# EAGLE schematic Klon (EAGLE 9.5.2)
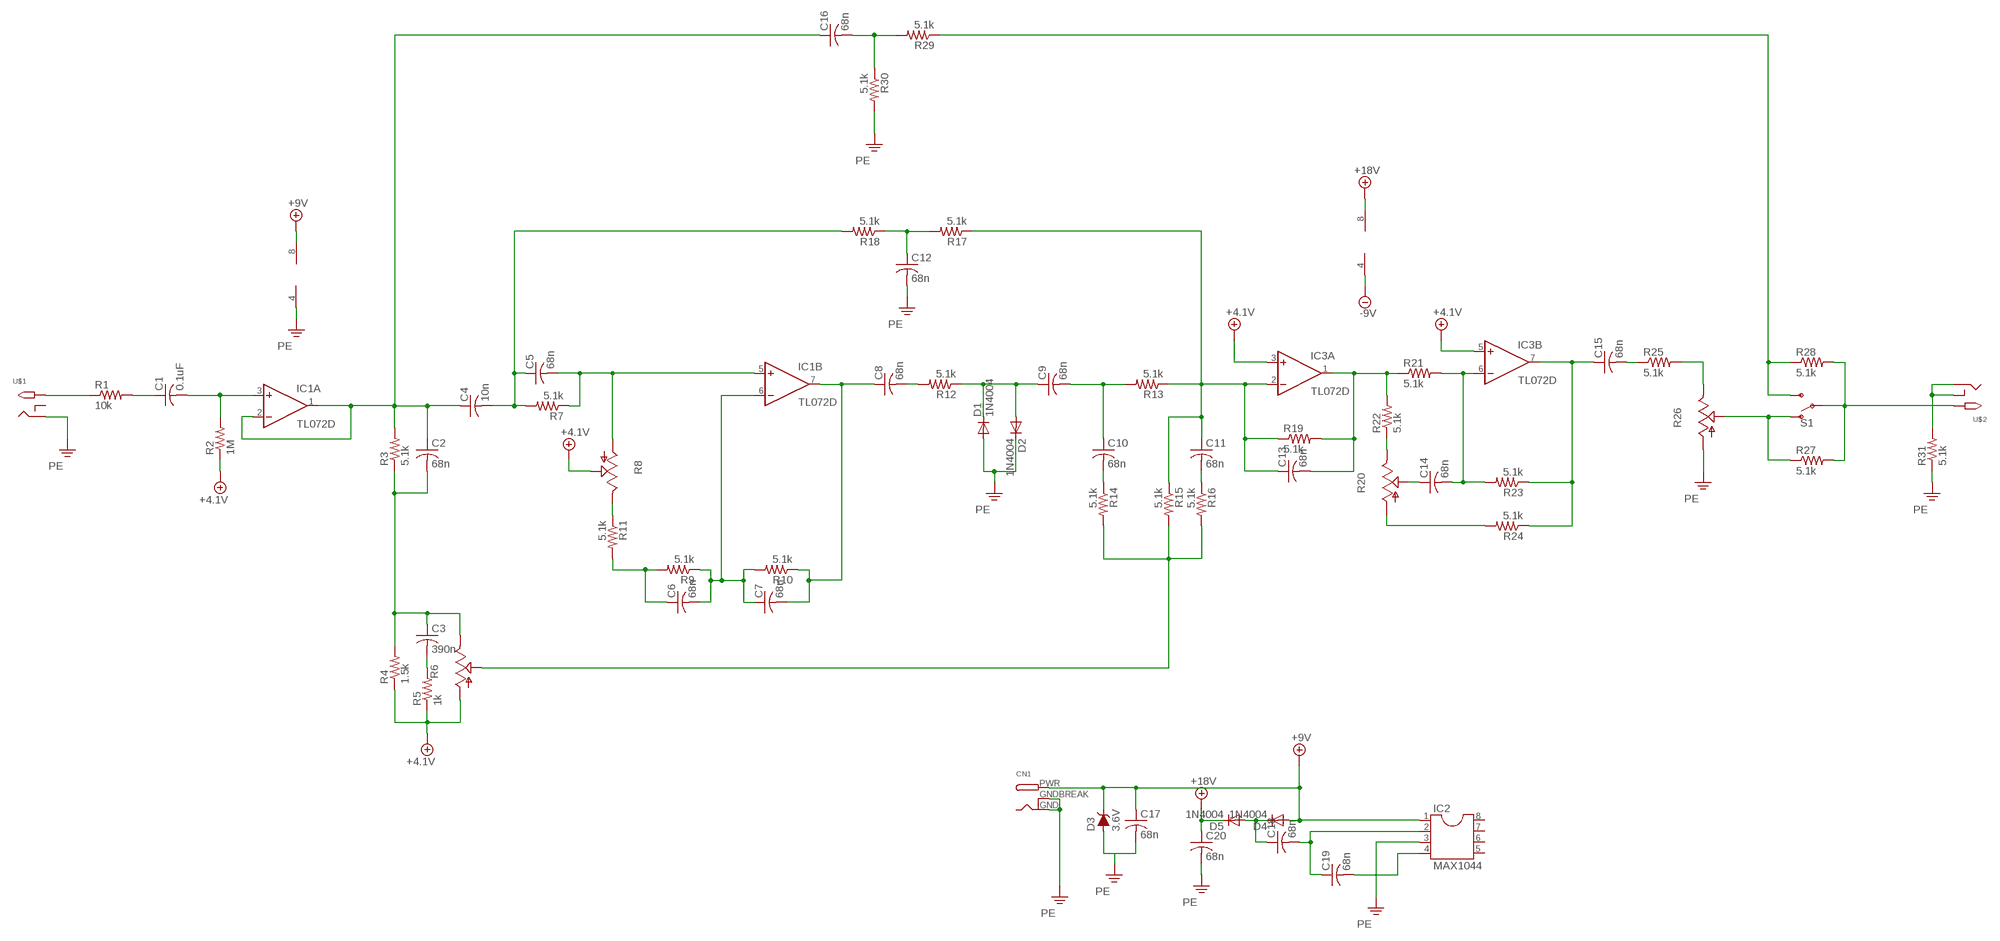
[diagram p0: schematic, sheet 1]

## Parts
C1  0.1uF  C-USC0603  [C0603]
C2  68n  C-USC0603  [C0603]
C3  390n  C-USC0603  [C0603]
C4  10n  C-USC0603  [C0603]
C5  68n  C-USC0603  [C0603]
C6  68n  C-USC0603  [C0603]
C7  68n  C-USC0603  [C0603]
C8  68n  C-USC0603  [C0603]
C9  68n  C-USC0603  [C0603]
C10  68n  C-USC0603  [C0603]
C11  68n  C-USC0603  [C0603]
C12  68n  C-USC0603  [C0603]
C13  68n  C-USC0603  [C0603]
C14  68n  C-USC0603  [C0603]
C15  68n  C-USC0603  [C0603]
C16  68n  C-USC0603  [C0603]
C17  68n  C-USC0603  [C0603]
C18  68n  C-USC0603  [C0603]
C19  68n  C-USC0603  [C0603]
C20  68n  C-USC0603  [C0603]
CN1  DCBARRELPTH  [DCJACK_2MM_PTH]
D1  1N4004  [DO41-10]
D2  1N4004  [DO41-10]
D3  3.6V  DIODE-ZENER-BZT52C3V6S  [SOD-323]
D4  1N4004  [DO41-10]
D5  1N4004  [DO41-10]
IC1  TL072D  [SO08]
IC2  MAX1044  [DIL08]
IC3  TL072D  [SO08]
R1  10k  R-US_R0603  [R0603]
R2  1M  R-US_R0603  [R0603]
R3  5.1k  R-US_R0603  [R0603]
R4  1.5k  R-US_R0603  [R0603]
R5  1k  R-US_R0603  [R0603]
R6  TRIM_US-3223G  [3223G]
R7  5.1k  R-US_R0603  [R0603]
R8  TRIM_US-3223G  [3223G]
R9  5.1k  R-US_R0603  [R0603]
R10  5.1k  R-US_R0603  [R0603]
R11  5.1k  R-US_R0603  [R0603]
R12  5.1k  R-US_R0603  [R0603]
R13  5.1k  R-US_R0603  [R0603]
R14  5.1k  R-US_R0603  [R0603]
R15  5.1k  R-US_R0603  [R0603]
R16  5.1k  R-US_R0603  [R0603]
R17  5.1k  R-US_R0603  [R0603]
R18  5.1k  R-US_R0603  [R0603]
R19  5.1k  R-US_R0603  [R0603]
R20  TRIM_US-3223G  [3223G]
R21  5.1k  R-US_R0603  [R0603]
R22  5.1k  R-US_R0603  [R0603]
R23  5.1k  R-US_R0603  [R0603]
R24  5.1k  R-US_R0603  [R0603]
R25  5.1k  R-US_R0603  [R0603]
R26  TRIM_US-3223G  [3223G]
R27  5.1k  R-US_R0603  [R0603]
R28  5.1k  R-US_R0603  [R0603]
R29  5.1k  R-US_R0603  [R0603]
R30  5.1k  R-US_R0603  [R0603]
R31  5.1k  R-US_R0603  [R0603]
S1  SWITCH-SPDT-PTH-11.6X4.0MM  [SWITCH_SPDT_PTH_11.6X4.0MM]
U$1  2.1MMJACKSMT  [DCJACK_2MM_SMT]
U$2  2.1MMJACKSMT  [DCJACK_2MM_SMT]

## Nets
+4.1V: IC3.3(A:+IN) IC3.5(B:+IN) R2.1 R4.1 R5.1 R6.1(A) R8.2(S)
+9V: C17.1 CN1.PWR D3.C D4.A IC1.8(P:V+) IC2.1
+18V: C20.1 D5.C IC3.8(P:V+)
-9V: IC3.4(P:V-)
N$1: C1.1 R1.2
N$2: C1.2 IC1.3(A:+IN) R2.2
N$3: C2.1 C4.1 C16.1 IC1.1(A:OUT) IC1.2(A:-IN) R3.2
N$4: C2.2 C3.1 R3.1 R4.2 R6.3(E)
N$5: C4.2 C5.1 R7.2 R18.2
N$6: C3.2 R5.2
N$7: C5.2 IC1.5(B:+IN) R7.1 R8.1(A)
N$8: C6.2 C7.1 IC1.6(B:-IN) R9.1 R10.2
N$9: R8.3(E) R11.1
N$10: C6.1 R9.2 R11.2
N$11: C7.2 C8.1 IC1.7(B:OUT) R10.1
N$12: C12.1 R17.2 R18.1
N$13: C8.2 R12.2
N$14: C9.1 D1.C D2.A R12.1
N$15: C9.2 C10.1 R13.2
N$16: C10.2 R14.1
N$17: R6.2(S) R14.2 R15.2 R16.2
N$18: C11.2 R16.1
N$19: C11.1 C13.1 IC3.2(A:-IN) R13.1 R15.1 R17.1 R19.1
N$20: C14.2 IC3.6(B:-IN) R21.2 R23.2
N$21: C13.2 IC3.1(A:OUT) R19.2 R21.1 R22.2
N$22: R20.3(E) R22.1
N$23: C14.1 R20.2(S)
N$24: R20.1(A) R24.2
N$25: C15.1 IC3.7(B:OUT) R23.1 R24.1
N$26: R26.2(S) R27.1 S1.1(O)
N$27: C15.2 R25.1
N$28: R25.2 R26.3(E)
N$29: R27.2 R28.2 S1.2(P) U$2.PWR2(TIP)
N$30: R28.1 R29.1 S1.3(S)
N$31: C16.2 R29.2 R30.1
N$32: R1.1 U$1.PWR2(TIP)
N$33: R31.2 U$2.GND(RING) U$2.GNDBREAK(RING_SW)
N$34: C18.2 C19.1 IC2.2
N$35: C18.1 D4.C D5.A
N$36: C19.2 IC2.4
PE: C12.2 C17.2 C20.2 CN1.GND CN1.GNDBREAK D1.A D2.C D3.A IC1.4(P:V-) IC2.3 R26.1(A) R30.2 R31.1 U$1.GND(RING)
Unconnected: IC2.5 IC2.6 IC2.7 IC2.8 U$1.GNDBREAK(RING_SW)

## Library data of the parts
C1-C20 = rcl:C-US: CAPACITOR, American symbol; SPICEPREFIX: C
CN1 = adafruit:DCBARREL: 2.0mm DC Barrel Jack DCJACK_2MM_PTH - Through Hole Jack (4UConnector: 05537)
D1 D2 D4 D5 = adafruit:1N4004: DIODE General purpose 1N400x type rectifier (With bigger pads) http://www.ladyada.net/library/pcb/eaglelibrary.html
D3 = SparkFun-DiscreteSemi:DIODE-ZENER: Zener Diode A Zener diode allows current to flow from its anode to its cathode like a normal semiconductor diode, but it also permits current to flow in the reverse direction when its "Zener voltage" is reached. - WIkipedia; PROD_ID: DIO-08199
IC1 IC3 = linear:TL072: OP AMP
IC2 = MAX1044:MAX1044; AVAILABILITY: Unavailable; DESCRIPTION: Charge Pump Switching Regulator IC Positive or Negative Fixed -Vin, nVin, Vin/2 1 Output 20mA 8-DIP (0.300, 7.62mm); MF: Maxim Integrated; MP: MAX1044; PACKAGE: DIP-8 Maxim Integrated; PRICE: None
R1-R5 R7 R9-R19 R21-R25 R27-R31 = rcl:R-US_: RESISTOR, American symbol; SPICEPREFIX: R
R6 R8 R20 R26 = pot:TRIM_US-: POTENTIOMETER
S1 = SparkFun-Switches:SWITCH-SPDT: Single Pole, Double Throw (SPDT) Switch Single-pole, double-throw (SPDT) switch. Variant Overview SMD-AYZ0202 Surface Mount DPDT Switch <https://www.sparkfun.com/products/597> (COM-00597) Used on e.g. LilyPad Arduino USB - ATmega32U4 Board <https://www.sparkfun.com/products/12049> PTH-11.6X4.0MM SPDT Mini Power Switch <https://www.sparkfun.com/products/102> (COM-00102) Used on e.g. SparkFun Simon Says - Through-Hole Soldering Kit <https://www.sparkfun.com/products/10547> (KIT-10547) PTH-11.6X4.0MM-KIT KIT version of SPDT Mini Power Switch - Simplifies soldering by removing tStop of switch pins - only one side can be soldered. PTH-11.6X4.0MM-LOCK LOCK version of SPDT Mini Power Switch - Offset pins hold switch in place for easier soldering. SMD-RIGHT-ANGLE Surface Mount Right Angle Switch <https://www.sparkfun.com/products/10860> (COM-10860) Used on e.g. SparkFun ESP8266 Thing <https://www.sparkfun.com/products/13231>; PROD_ID: SWCH-08261; SF_SKU: COM-00102
U$1 U$2 = adafruit:2.1MMJACK: 2.1mm x 5.5mm THM DC jack with internal switch. Digikey part #PJ-102A, 4UCON part #05537 2.1mm x 5.5mm SMT DC jack with internal switch. Digikey part #PJ-002A-SMT, 4UCON part #03267 By microbuilder.eu & adafruit.com